# EAGLE design readhead-0805 (EAGLE 6.4)
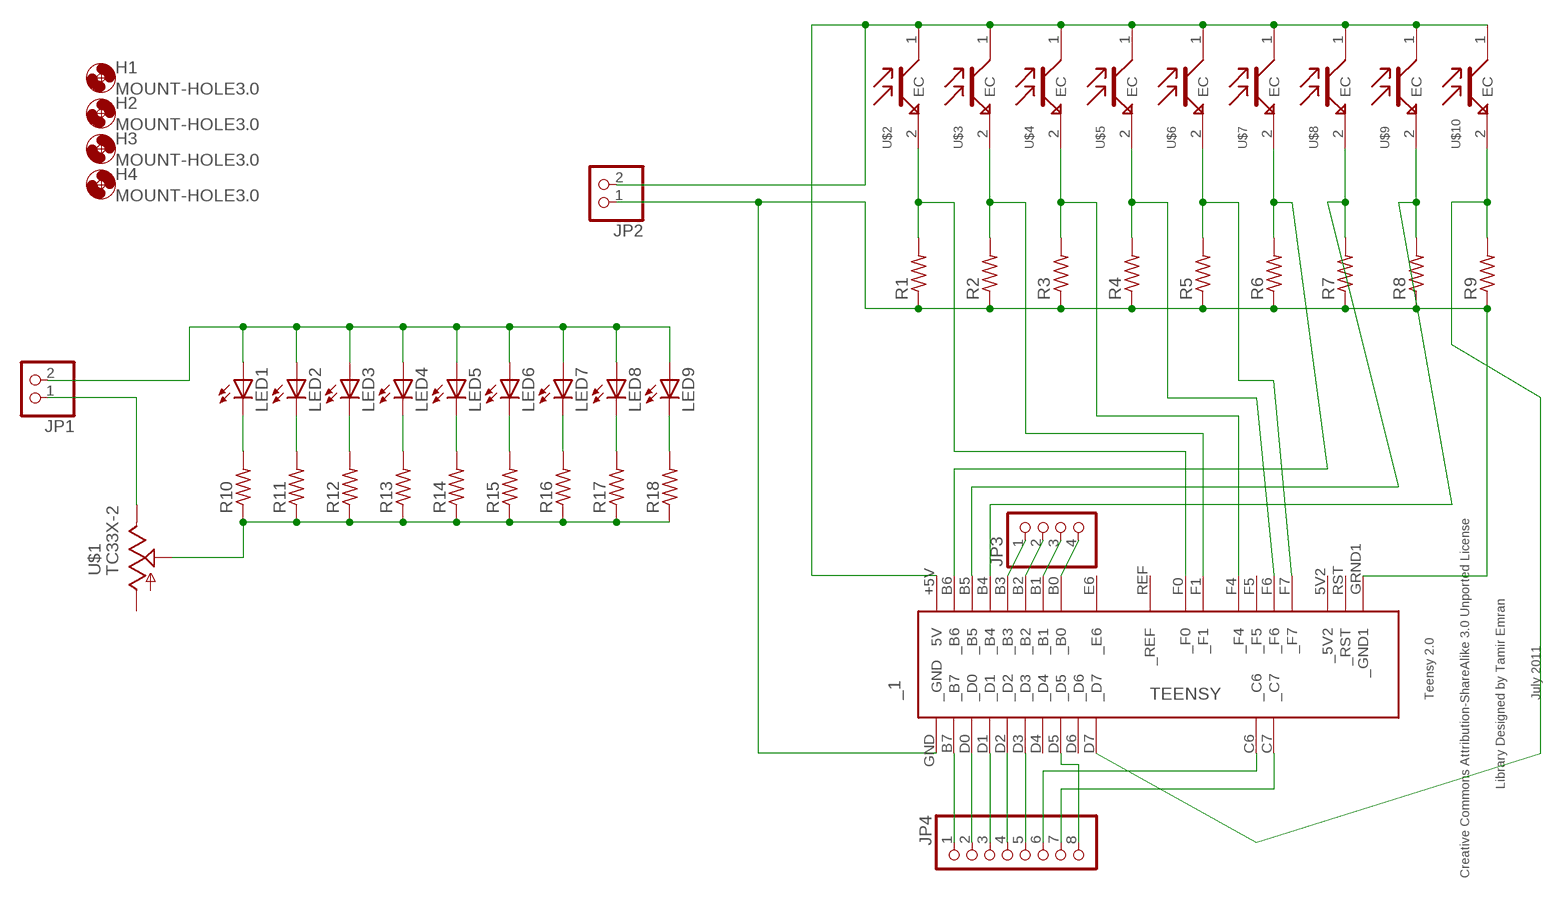
[diagram p0: schematic, sheet 1]

## Parts
_1  TEENSY  [TEENSY]
H1  MOUNT-HOLE3.0  [3,0]
H2  MOUNT-HOLE3.0  [3,0]
H3  MOUNT-HOLE3.0  [3,0]
H4  MOUNT-HOLE3.0  [3,0]
JP1  PINHD-1X2  [1X02]
JP2  PINHD-1X2  [1X02]
JP3  PINHD-1X4  [1X04]
JP4  PINHD-1X8  [1X08]
LED1  LEDCHIPLED_0805  [CHIPLED_0805]
LED2  LEDCHIPLED_0805  [CHIPLED_0805]
LED3  LEDCHIPLED_0805  [CHIPLED_0805]
LED4  LEDCHIPLED_0805  [CHIPLED_0805]
LED5  LEDCHIPLED_0805  [CHIPLED_0805]
LED6  LEDCHIPLED_0805  [CHIPLED_0805]
LED7  LEDCHIPLED_0805  [CHIPLED_0805]
LED8  LEDCHIPLED_0805  [CHIPLED_0805]
LED9  LEDCHIPLED_0805  [CHIPLED_0805]
R1  R-US_R0805  [R0805]
R2  R-US_R0805  [R0805]
R3  R-US_R0805  [R0805]
R4  R-US_R0805  [R0805]
R5  R-US_R0805  [R0805]
R6  R-US_R0805  [R0805]
R7  R-US_R0805  [R0805]
R8  R-US_R0805  [R0805]
R9  R-US_R0805  [R0805]
R10  R-US_R0805  [R0805]
R11  R-US_R0805  [R0805]
R12  R-US_R0805  [R0805]
R13  R-US_R0805  [R0805]
R14  R-US_R0805  [R0805]
R15  R-US_R0805  [R0805]
R16  R-US_R0805  [R0805]
R17  R-US_R0805  [R0805]
R18  R-US_R0805  [R0805]
U$1  TC33X-2  [TC33X-2]
U$2  OP501DA  [R0805]
U$3  OP501DA  [R0805]
U$4  OP501DA  [R0805]
U$5  OP501DA  [R0805]
U$6  OP501DA  [R0805]
U$7  OP501DA  [R0805]
U$8  OP501DA  [R0805]
U$9  OP501DA  [R0805]
U$10  OP501DA  [R0805]

## Nets
N$1: LED1.C R10.2
N$2: LED2.C R11.2
N$3: LED3.C R12.2
N$4: LED4.C R13.2
N$5: LED5.C R14.2
N$6: LED6.C R15.2
N$7: LED7.C R16.2
N$8: LED8.C R17.2
N$9: LED9.C R18.2
N$10: _1.F4(_F4) R3.2 U$4.2(E)
N$11: _1.F1(_F1) R2.2 U$3.2(E)
N$12: _1.F6(_F6) R4.2 U$5.2(E)
N$13: _1.F7(_F7) R5.2 U$6.2(E)
N$14: _1.B6(_B6) R6.2 U$7.2(E)
N$18: _1.B3(_B3) JP3.1
N$19: _1.GND(_GND) _1.GRND1(_GND1) JP2.1 R1.1 R2.1 R3.1 R4.1 R5.1 R6.1 R7.1 R8.1 R9.1
N$20: _1.F0(_F0) R1.2 U$2.2(E)
N$21: JP1.2 LED1.A LED2.A LED3.A LED4.A LED5.A LED6.A LED7.A LED8.A LED9.A
N$22: R10.1 R11.1 R12.1 R13.1 R14.1 R15.1 R16.1 R17.1 R18.1 U$1.P$2(S)
N$23: JP1.1 U$1.P$3(E)
N$24: _1.+5V(5V) JP2.2 U$2.1(C) U$3.1(C) U$4.1(C) U$5.1(C) U$6.1(C) U$7.1(C) U$8.1(C) U$9.1(C) U$10.1(C)
N$25: _1.B2(_B2) JP3.2
N$26: _1.B1(_B1) JP3.3
N$27: _1.B0(_B0) JP3.4
N$28: _1.B7(_B7) JP4.1
N$29: _1.D0(_D0) JP4.2
N$30: _1.D1(_D1) JP4.3
N$31: _1.D2(_D2) JP4.4
N$32: _1.D3(_D3) JP4.5
N$33: _1.C6(_C6) JP4.6
N$34: _1.C7(_C7) JP4.7
N$35: _1.D5(_D5) JP4.8
N$36: _1.B5(_B5) R7.2 U$8.2(E)
N$37: _1.B4(_B4) R8.2 U$9.2(E)
N$38: _1.D7(_D7) R9.2 U$10.2(E)
Unconnected: _1.5V2(_5V2) _1.D4(_D4) _1.D6(_D6) _1.E6(_E6) _1.F5(_F5) _1.REF(_REF) _1.RST(_RST) U$1.P$1(A)

## Library data of the parts
_1 = teensy:TEENSY: Teensy 2.0 Original Design by Clint Fisher Modified Design by Tamir Emran Licensed Under Creative Commons Attribution-ShareAlike 3.0 Unported (CC BY-SA 3.0)
H1-H4 = holes:MOUNT-HOLE: MOUNTING HOLE with drill center marker
JP1 JP2 = pinhead:PINHD-1X2: PIN HEADER
JP3 = pinhead:PINHD-1X4: PIN HEADER
JP4 = pinhead:PINHD-1X8: PIN HEADER
LED1-LED9 = adafruit:LED: LED OSRAM: - CHIPLED LG R971, LG N971, LY N971, LG Q971, LY Q971, LO R971, LY R971 LH N974, LH R974 LS Q976, LO Q976, LY Q976 LO Q996 - Hyper CHIPLED LW Q18S LB Q993, LB Q99A, LB R99A - SideLED LS A670, LO A670, LY A670, LG A670, LP A670 LB A673, LV A673, LT A673, LW A673 LH A674 LY A675 LS A676, LA A676, LO A676, LY A676, LW A676 LS A679, LY A679, LG A679 - Hyper Micro SIDELED® LS Y876, LA Y876, LO Y876, LY Y876 LT Y87S - SmartLED LW L88C, LW L88S LB L89C, LB L89S, LG L890 LS L89K, LO L89K, LY L89K LS L896, LA L896, LO L896, LY L896 - TOPLED LS T670, LO T670, LY T670, LG T670, LP T670 LSG T670, LSP T670, LSY T670, LOP T670, LYG T670 LG T671, LOG T671, LSG T671 LB T673, LV T673, LT T673, LW T673 LH T674 LS T676, LA T676, LO T676, LY T676, LB T676, LH T676, LSB T676, LW T676 LB T67C, LV T67C, LT T67C, LS T67K, LO T67K, LY T67K, LW E67C LS E67B, LA E67B, LO E67B, LY E67B, LB E67C, LV E67C, LT E67C LW T67C LS T679, LY T679, LG T679 LS T770, LO T770, LY T770, LG T770, LP T770 LB T773, LV T773, LT T773, LW T773 LH T774 LS E675, LA E675, LY E675, LS T675 LS T776, LA T776, LO T776, LY T776, LB T776 LHGB T686 LT T68C, LB T68C - Hyper Mini TOPLED® LB M676 - Mini TOPLED Santana® LG M470 LS M47K, LO M47K, LY M47K Source: http://www.osram.convergy.de/
R1-R18 = adafruit:R-US_: RESISTOR, American symbol
U$1 = vreg:TC33X-2
U$2-U$10 = phototransistors:OP501DA

## Board
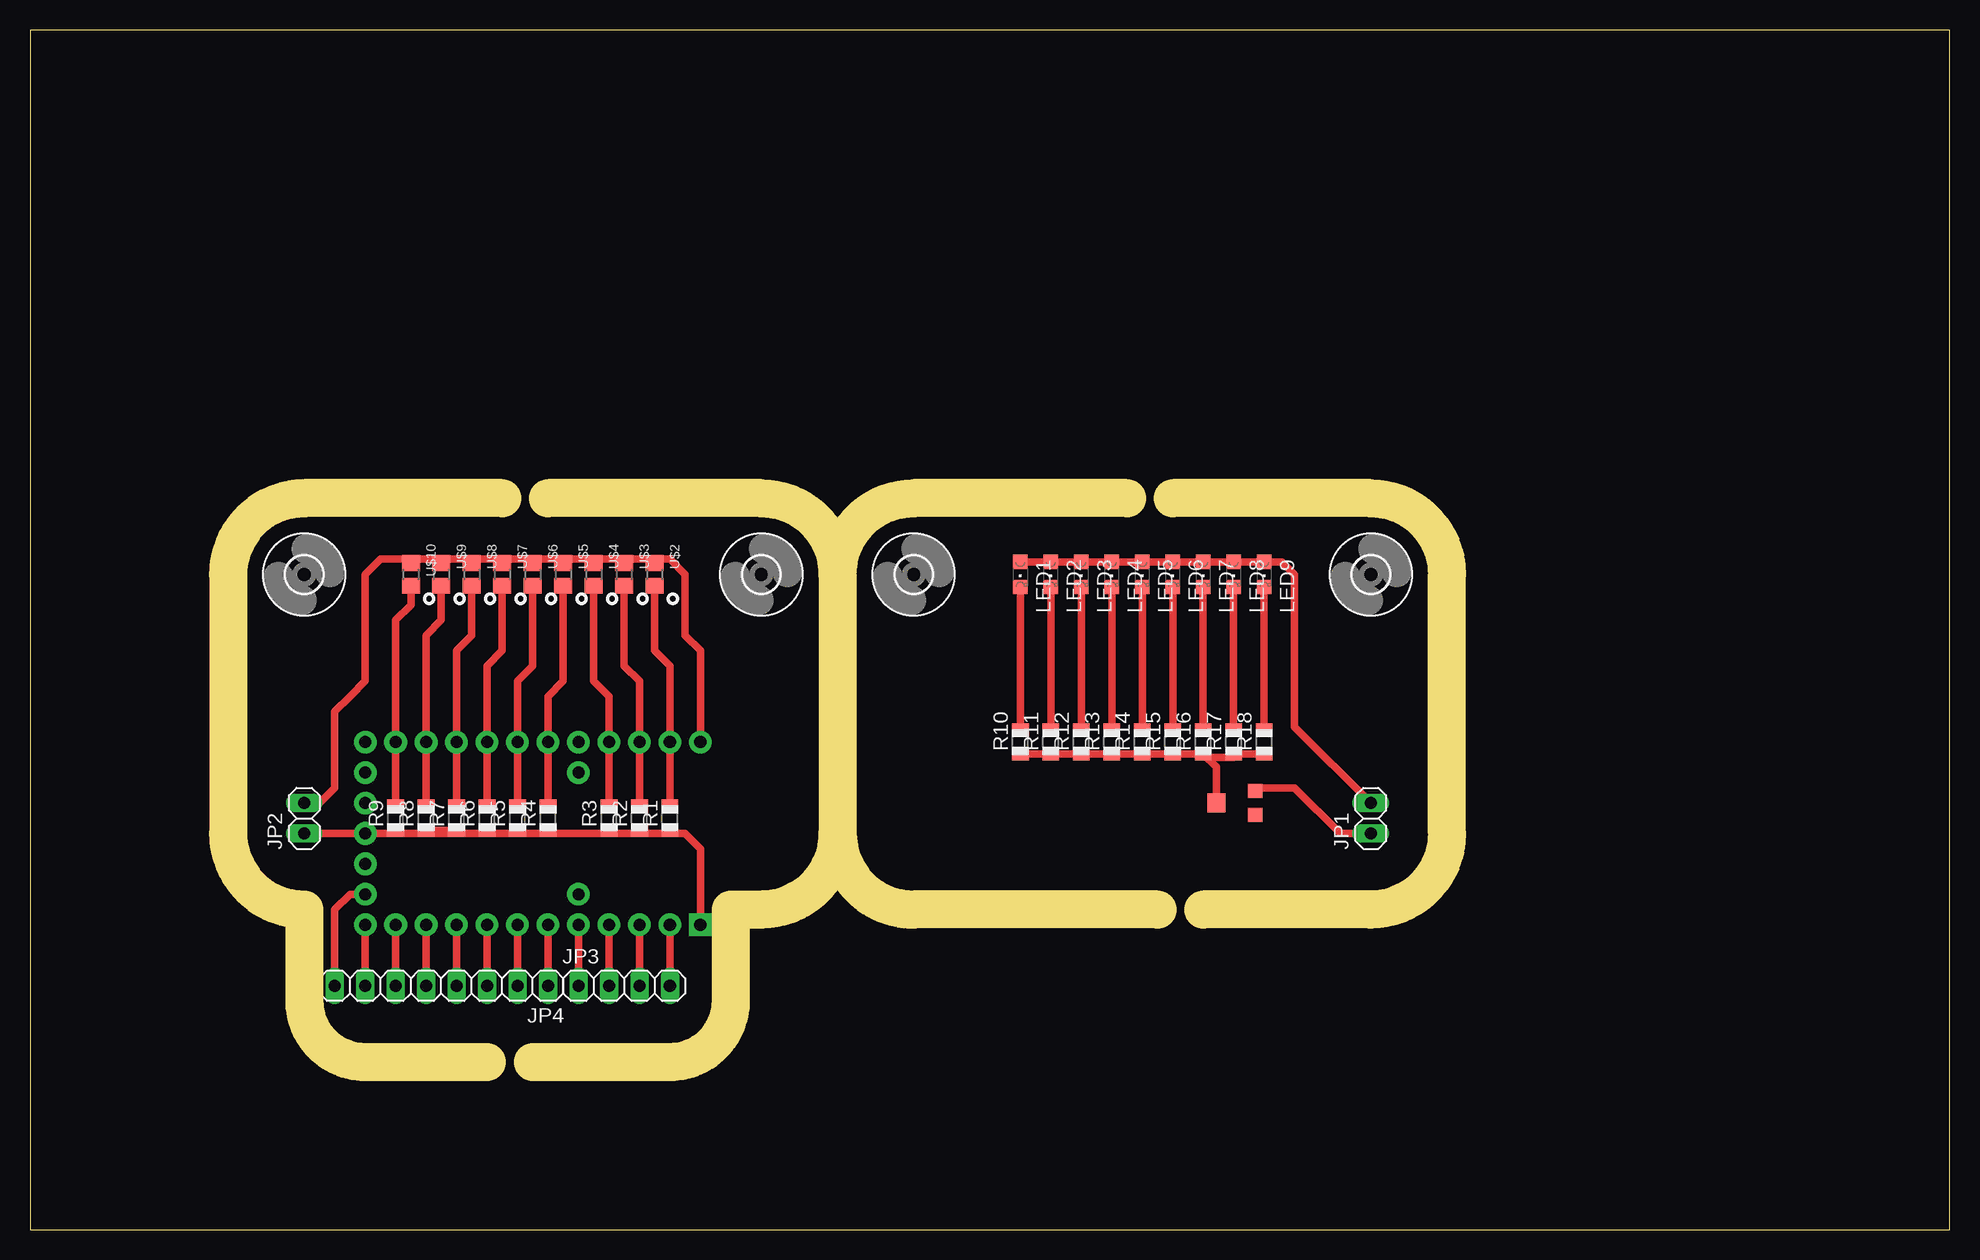
[diagram p1: board, top side]
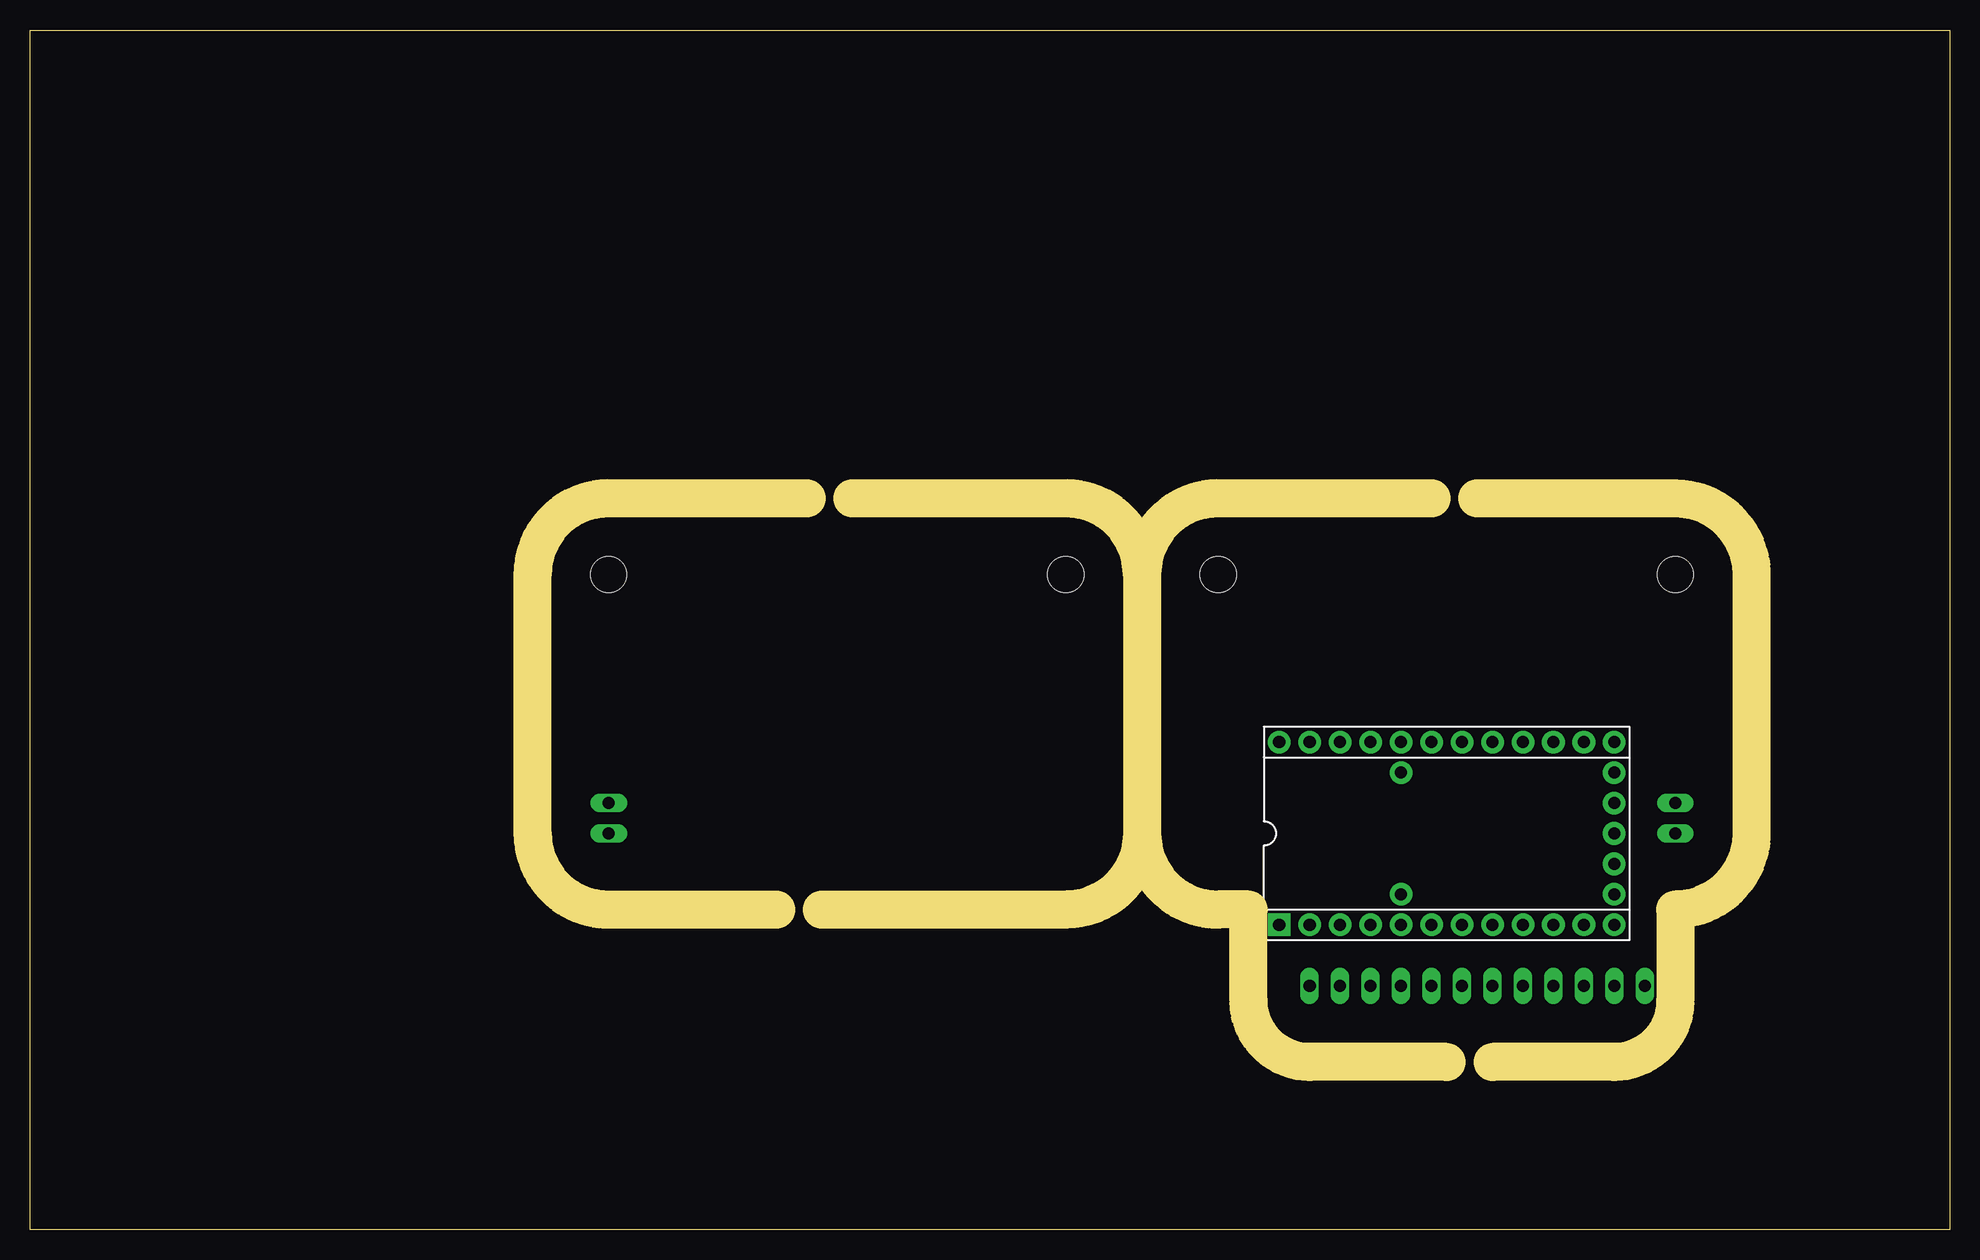
[diagram p2: board, bottom side, seen from below]

Size 160 x 100 mm. Coordinates in mm from the lower left corner, seen from the top.
Outline: 0,0 160,0 160,100 0,100 0,0
Copper layers (1*16): Top 0.035mm / dielectric 1.5mm / Bottom 0.035mm
Design rules "default": minimum track width 10mil, minimum drill 24mil, track to track 8mil, track to pad 8mil, pad to pad 8mil, via to via 8mil, smd to smd 8mil, copper to edge 40mil, drill to drill 8mil, minimum pad ring 10mil, minimum via ring 8mil, stop-mask expansion 4mil, vias tented up to drill 0mil, thermal gap 10mil
Milling: 24 lines

### Footprints (pad centres in the part's own frame; a part is rotated, then mirrored left to right if it is on the bottom)
TEENSY = drill 1.016 pad 1.88: 5V2 13.97,-2.54; +5V -13.97,7.62; B0 -11.43,-7.62; B1 -8.89,-7.62; B2 -6.35,-7.62; B3 -3.81,-7.62; B4 8.89,7.62; B5 6.35,7.62; B6 3.81,7.62; B7 -1.27,-7.62; C6 11.43,-7.62; C7 13.97,-7.62; D0 1.27,-7.62; D1 3.81,-7.62; D2 6.35,-7.62; D3 8.89,-7.62; D4 13.97,5.08; D5 13.97,-5.08; D6 13.97,7.62; D7 11.43,7.62; E6 -3.81,-5.08; F0 -11.43,7.62; F1 -8.89,7.62; F4 -6.35,7.62; F5 -3.81,7.62; F6 -1.27,7.62; F7 1.27,7.62; GRND1 13.97,0; REF -3.81,5.08; RST 13.97,2.54 | drill 1.016 pad 1.88 square: GND -13.97,-7.62
3,0 = hole 3: 0,0
1X02 = drill 1.016 long: 1 -1.27,0; 2 1.27,0
1X04 = drill 1.016 long: 1 -3.81,0; 2 -1.27,0; 3 1.27,0; 4 3.81,0
1X08 = drill 1.016 long: 1 -8.89,0; 2 -6.35,0; 3 -3.81,0; 4 -1.27,0; 5 1.27,0; 6 3.81,0; 7 6.35,0; 8 8.89,0
CHIPLED_0805 = smd 1.2 x 1.2: A 0,-1.05; C 0,1.05
R0805 = smd 1.1 x 1.4: 1 -1,0; 2 1,0
TC33X-2 = smd 1.2 x 1.2: P$1 -1,-1.8; P$3 1,-1.8 | smd 1.6 x 1.5: P$2 0,1.45
R0805' = smd 1.3 x 1.5: 1 -0.95,0; 2 0.95,0

### Placement (x,y rotation side)
_1  41.91,33.02 0 bottom
H1  22.86,54.61 0 top
H2  60.96,54.61 0 top
H3  111.76,54.61 0 top
H4  73.66,54.61 0 top
JP1  111.76,34.29 90 top
JP2  22.86,34.29 90 top
JP3  49.53,20.32 0 top
JP4  34.29,20.32 180 top
LED1  82.55,54.61 180 top
LED2  85.09,54.61 180 top
LED3  87.63,54.61 180 top
LED4  90.17,54.61 180 top
LED5  92.71,54.61 180 top
LED6  95.25,54.61 180 top
LED7  97.79,54.61 180 top
LED8  100.33,54.61 180 top
LED9  102.87,54.61 180 top
R1  53.34,34.29 90 top
R2  50.8,34.29 90 top
R3  48.26,34.29 90 top
R4  43.18,34.29 90 top
R5  40.64,34.29 90 top
R6  38.1,34.29 90 top
R7  35.56,34.29 90 top
R8  33.02,34.29 90 top
R9  30.48,34.29 90 top
R10  82.55,40.64 90 top
R11  85.09,40.64 90 top
R12  87.63,40.64 90 top
R13  90.17,40.64 90 top
R14  92.71,40.64 90 top
R15  95.25,40.64 90 top
R16  97.79,40.64 90 top
R17  100.33,40.64 90 top
R18  102.87,40.64 90 top
U$1  100.33,35.56 90 top
U$2  OP501DA  [R0805']  52.07,54.61 270 top
U$3  OP501DA  [R0805']  49.53,54.61 270 top
U$4  OP501DA  [R0805']  46.99,54.61 270 top
U$5  OP501DA  [R0805']  44.45,54.61 270 top
U$6  OP501DA  [R0805']  41.91,54.61 270 top
U$7  OP501DA  [R0805']  39.37,54.61 270 top
U$8  OP501DA  [R0805']  36.83,54.61 270 top
U$9  OP501DA  [R0805']  34.29,54.61 270 top
U$10  OP501DA  [R0805']  31.75,54.61 270 top

### Tracks (layer width: path | path; a pad name or v marks a point on that pad's centre or on a via)
N$1
  Top 0.61: LED1.C R10.2
N$2
  Top 0.61: R11.2 LED2.C
N$3
  Top 0.61: LED3.C R12.2
N$4
  Top 0.61: R13.2 LED4.C
N$5
  Top 0.61: LED5.C R14.2
N$6
  Top 0.61: R15.2 LED6.C
N$7
  Top 0.61: LED7.C R16.2
N$8
  Top 0.61: R17.2 LED8.C
N$9
  Top 0.61: LED9.C R18.2
N$10
  Top 0.61: U$4.2 46.99,45.72 48.26,44.45 _1.F4 R3.2
N$11
  Top 0.61: U$3.2 49.53,46.99 50.8,45.72 _1.F1 R2.2
N$12
  Top 0.61: U$5.2 44.45,45.72 43.18,44.45 _1.F6 R4.2
N$13
  Top 0.61: U$6.2 41.91,46.99 40.64,45.72 _1.F7 R5.2
N$14
  Top 0.61: U$7.2 39.37,48.26 38.1,46.99 _1.B6 R6.2
N$18
  Top 0.61: JP3.1 _1.B3
N$19
  Top 0.61: JP2.1 _1.GRND1 | _1.GND 55.88,31.75 54.61,33.02 53.34,33.02 | 53.34,33.02 50.8,33.02 | 50.8,33.02 48.26,33.02 | 48.26,33.02 43.18,33.02 | 43.18,33.02 40.64,33.02 | 40.64,33.02 38.1,33.02 | 38.1,33.02 35.56,33.02 | 35.56,33.02 33.02,33.02 | 33.02,33.02 _1.GRND1 | _1.GRND1 30.21,33.02 R9.1 | 33.02,33.02 R8.1 R7.1 35.56,33.02 | R6.1 38.1,33.02 | R5.1 40.64,33.02 | R4.1 43.18,33.02 | R3.1 48.26,33.02 | R2.1 50.8,33.02 | R1.1 53.34,33.02
N$20
  Top 0.61: U$2.2 52.07,48.26 53.34,46.99 _1.F0 R1.2
N$21
  Top 0.61: LED1.A LED2.A LED3.A LED4.A LED5.A LED6.A LED7.A LED8.A LED9.A 104.36,55.66 105.41,54.61 105.41,41.91 JP1.2
N$22
  Top 0.61: R18.1 R17.1 100.33,39.37 98.06,39.37 R16.1 | R16.1 R15.1 R14.1 R13.1 R12.1 R11.1 R10.1 | U$1.P$2 98.88,38.55 R16.1
N$23
  Top 0.61: JP1.1 109.22,33.02 105.41,36.83 102.4,36.83 U$1.P$3
N$24
  Top 0.61: _1.+5V 55.88,48.26 54.61,49.53 54.61,54.61 53.34,55.88 52.07,55.88 | 52.07,55.88 49.53,55.88 | 49.53,55.88 46.99,55.88 | 46.99,55.88 44.45,55.88 | 44.45,55.88 41.91,55.88 | 41.91,55.88 39.37,55.88 | 39.37,55.88 36.83,55.88 | 36.83,55.88 34.29,55.88 | 34.29,55.88 32.07,55.88 U$10.1 31.43,55.88 29.21,55.88 27.94,54.61 27.94,45.72 26.67,44.45 25.4,43.18 25.4,36.83 24.13,35.56 JP2.2 | U$9.1 34.29,55.88 | U$8.1 36.83,55.88 | U$7.1 39.37,55.88 | U$6.1 41.91,55.88 | U$5.1 44.45,55.88 | U$4.1 46.99,55.88 | U$3.1 49.53,55.88 | U$2.1 52.07,55.88
N$25
  Top 0.61: _1.B2 JP3.2
N$26
  Top 0.61: _1.B1 JP3.3
N$27
  Top 0.61: _1.B0 JP3.4
N$28
  Top 0.61: _1.B7 JP4.1
N$29
  Top 0.61: JP4.2 _1.D0
N$30
  Top 0.61: _1.D1 JP4.3
N$31
  Top 0.61: JP4.4 _1.D2
N$32
  Top 0.61: _1.D3 JP4.5
N$33
  Top 0.61: JP4.6 _1.C6
N$34
  Top 0.61: _1.C7 JP4.7
N$35
  Top 0.61: _1.D5 26.67,27.94 25.4,26.67 JP4.8
N$36
  Top 0.61: U$8.2 36.83,49.53 35.56,48.26 _1.B5 R7.2
N$37
  Top 0.61: U$9.2 34.29,50.8 33.02,49.53 _1.B4 R8.2
N$38
  Top 0.61: U$10.2 31.75,52.07 30.48,50.8 _1.D7 R9.2